# Altium schematic sheet stm32最小系统.SchDoc
size A4
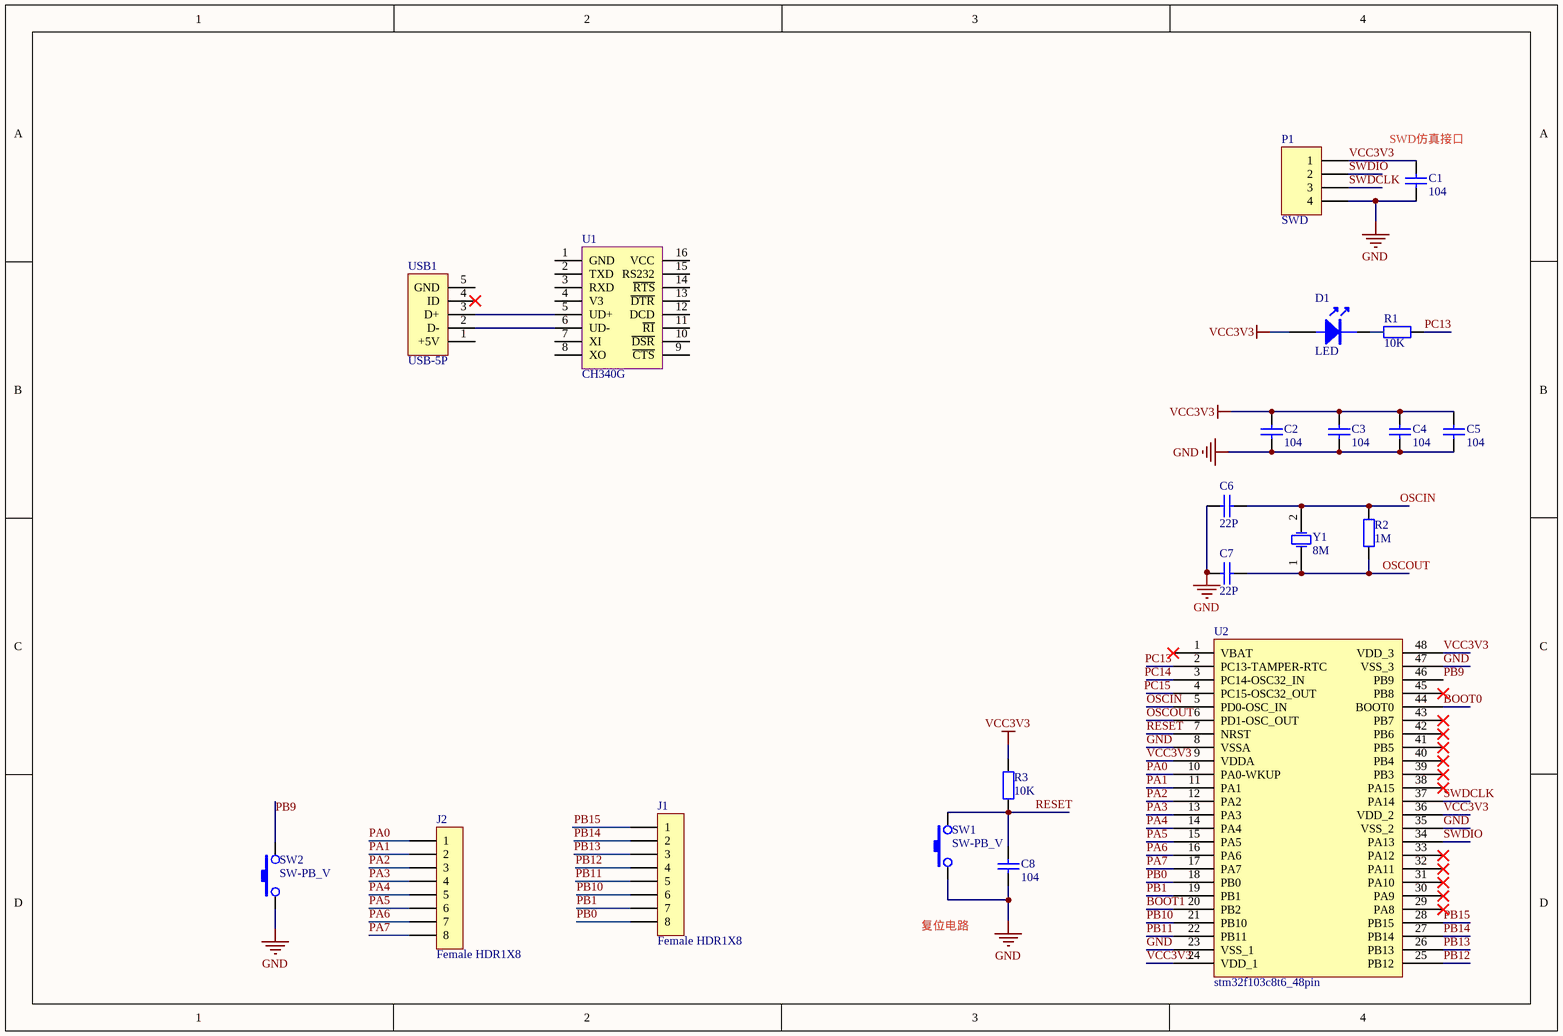
[diagram p0: stm32最小系统.SchDoc]

## Parts
C1  104  [0805R]
C2  104  [0805R]
C3  104
C4  104
C5  104
C6  22P
C7  22P
C8  104  [0805C]
D1  LED  [LED 0805G]
J1  Female HDR1X8  [Fe-HDR1X8/2.54-S]
J2  Female HDR1X8  [Fe-HDR1X8/2.54-S]
P1  SWD  [HDR-1X4_H]
R1  10K  [C0805]
R2  1M  [C0805]
R3  10K  [C0805]
SW1  SW-PB_V  [TSW SMD-3*6*2.5]
SW2  SW-PB_V  [TSW SMD-3*6*2.5]
U1  CH340G
U2  stm32f103c8t6_48pin  [TQFP48 7x7_L]
USB1  USB-5P  [USB-MICRO_E]
Y1  8M  [XTAL-49S DIP]

## Nets
GND: C1.1 C2.1 C3.1 C4.1 C5.1 C6.2 C7.2 C8.1 P1.4 SW1.1 SW2.1 U2.8(VSSA) U2.23(VSS_1) U2.35(VSS_2) U2.47(VSS_3)
VCC3V3: C1.2 C2.2 C3.2 C4.2 C5.2 D1.1 P1.1 R3.2 U2.9(VDDA) U2.24(VDD_1) U2.36(VDD_2) U2.48(VDD_3)
BOOT0: U2.44(BOOT0)
BOOT1: U2.20(PB2)
OSCIN: C6.1 R2.2 U2.5(PD0-OSC_IN) Y1.2(OSC2)
OSCOUT: C7.1 R2.1 U2.6(PD1-OSC_OUT) Y1.1(OSC1)
PA0: J2.1 U2.10(PA0-WKUP)
PA1: J2.2 U2.11(PA1)
PA2: J2.3 U2.12(PA2)
PA3: J2.4 U2.13(PA3)
PA4: J2.5 U2.14(PA4)
PA5: J2.6 U2.15(PA5)
PA6: J2.7 U2.16(PA6)
PA7: J2.8 U2.17(PA7)
PB0: J1.8 U2.18(PB0)
PB1: J1.7 U2.19(PB1)
PB9: SW2.2 U2.46(PB9)
PB10: J1.6 U2.21(PB10)
PB11: J1.5 U2.22(PB11)
PB12: J1.4 U2.25(PB12)
PB13: J1.3 U2.26(PB13)
PB14: J1.2 U2.27(PB14)
PB15: J1.1 U2.28(PB15)
PC13: R1.2 U2.2(PC13-TAMPER-RTC)
PC14: U2.3(PC14-OSC32_IN)
PC15: U2.4(PC15-OSC32_OUT)
RESET: C8.2 R3.1 SW1.2 U2.7(NRST)
SWDCLK: P1.3 U2.37(PA14)
SWDIO: P1.2 U2.34(PA13)
NetD1_2: D1.2 R1.1
NetU1_5: U1.5(UD+) USB1.3(D+)
NetU1_6: U1.6(UD-) USB1.2(D-)

Not connected (* = marked no-connect by the designer): U1 1(GND) 2(TXD) 3(RXD) 4(V3) 7(XI) 8(XO) 9(~{CTS}) 10(~{DSR}) 11(~{RI}) 12(DCD) 13(~{DTR}) 14(~{RTS}) 15(RS232) 16(VCC); U2 1(VBAT)* 29(PA8)* 30(PA9)* 31(PA10)* 32(PA11)* 33(PA12)* 38(PA15)* 39(PB3)* 40(PB4)* 41(PB5)* 42(PB6)* 43(PB7)* 45(PB8)*; USB1 1(+5V) 4(ID)* 5(GND)

## Notes on the sheet
- (near C1) SWD仿真接口
- 复位电路

## Library data of the parts
C1-C5 C8 = Cap: Published: 8-Jun-2000; LatestRevisionDate: 17-Jul-2002; LatestRevisionNote: Re-released for DXP Platform.; Publisher: Altium Limited; Value: 104
C6 C7 = Cap: Capacitor; Value: 104; Published: 8-Jun-2000; LatestRevisionDate: 17-Jul-2002; LatestRevisionNote: Re-released for DXP Platform.; Publisher: Altium Limited
P1 = Header 4: Header, 4-Pin; LatestRevisionDate: 17-Jul-2002; LatestRevisionNote: Re-released for DXP Platform.; Publisher: Altium Limited
R1 R3 = Res2: Published: 8-Jun-2000; LatestRevisionDate: 17-Jul-2002; LatestRevisionNote: Re-released for DXP Platform.; Publisher: Altium Limited
R2 = Res2: Resistor; Published: 8-Jun-2000; LatestRevisionDate: 17-Jul-2002; LatestRevisionNote: Re-released for DXP Platform.; Publisher: Altium Limited
USB1 = USB-5P: 微型USB母座; 版权归属: 源创客; BOM名称: 微型USB母座; 学习资源: www.ooocke.com
Y1 = XTAL: Crystal Oscillator; Published: 8-Jun-2000; LatestRevisionDate: 17-Jul-2002; LatestRevisionNote: Re-released for DXP Platform.; Publisher: Altium Limited